# Altium project 2560_TrainingKit.PrjPcb (part 1 of 4)
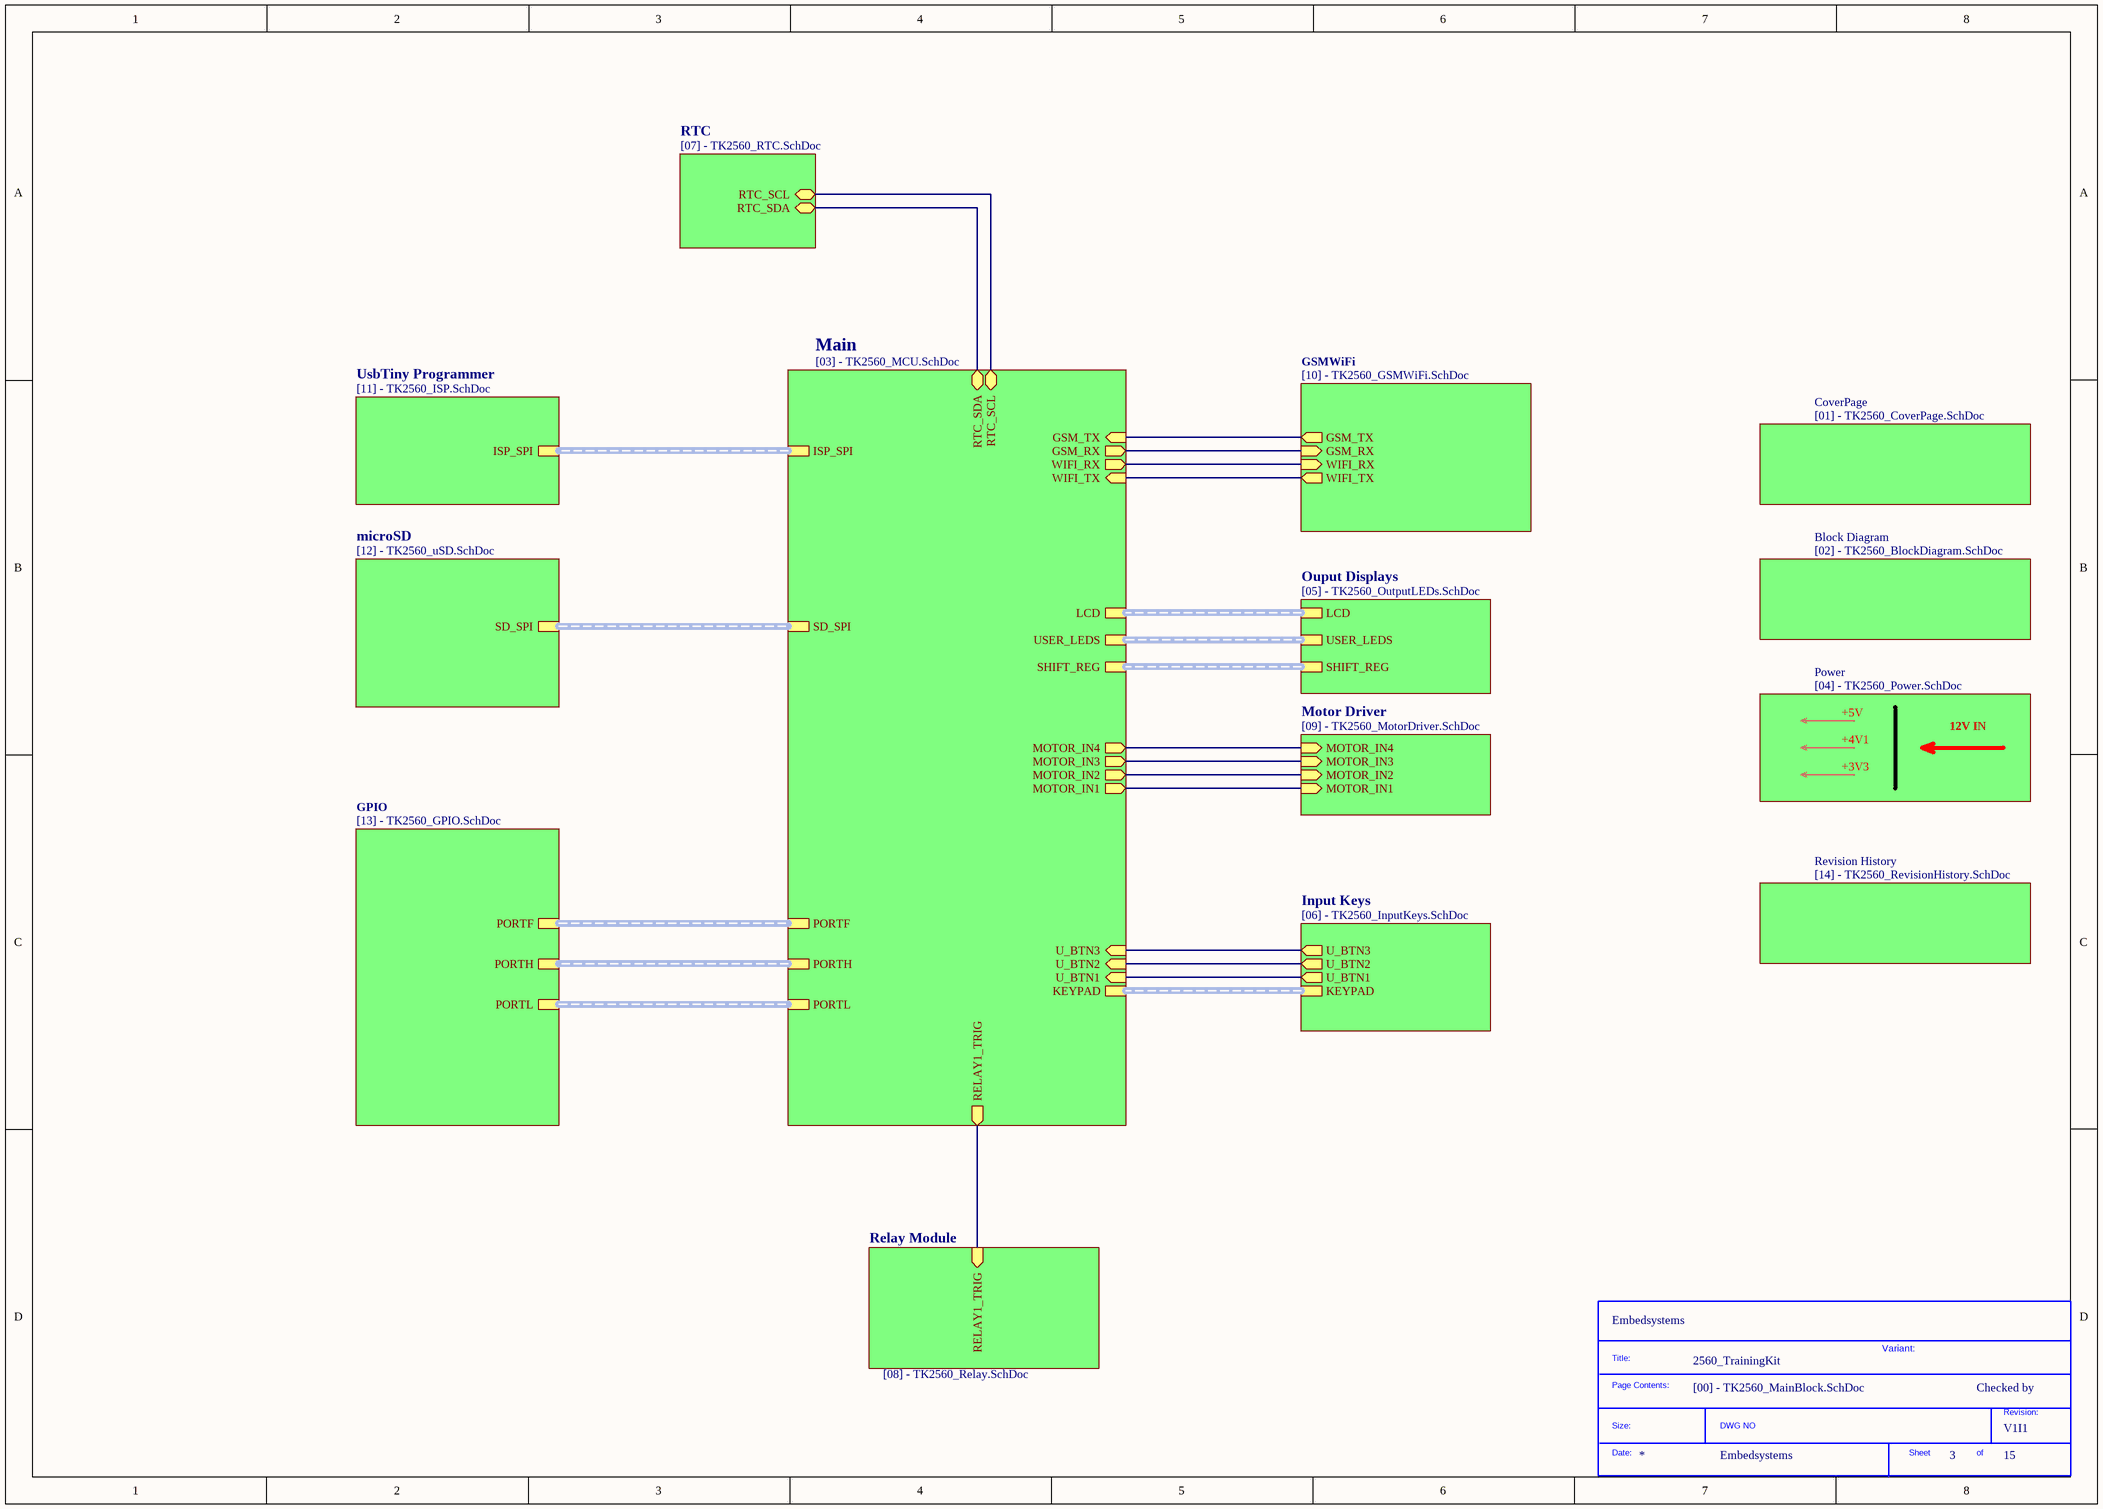
[diagram p0: [00] - TK2560_MainBlock.SchDoc]
COMPANY: Embedsystems; NotFitted: NF; Project: 2560_TrainingKit; Title: 2560_TrainingKit; VersionRevision: V1I1
15 sheets, 182 parts. Net scope: hierarchical (ports join the sheet entries above them; power ports are global).
Board file: TK2560_PCB.PcbDoc
Sheets:
  [00] - TK2560_MainBlock.SchDoc
    Main = [03] - TK2560_MCU.SchDoc
    Power = [04] - TK2560_Power.SchDoc
    Input Keys = [06] - TK2560_InputKeys.SchDoc
    Ouput Displays = [05] - TK2560_OutputLEDs.SchDoc
    CoverPage = [01] - TK2560_CoverPage.SchDoc
    Block Diagram = [02] - TK2560_BlockDiagram.SchDoc
    Motor Driver = [09] - TK2560_MotorDriver.SchDoc
    UsbTiny Programmer = [11] - TK2560_ISP.SchDoc
    RTC = [07] - TK2560_RTC.SchDoc
    Relay Module = [08] - TK2560_Relay.SchDoc
    microSD = [12] - TK2560_uSD.SchDoc
    Revision History = [14] - TK2560_RevisionHistory.SchDoc
    GPIO = [13] - TK2560_GPIO.SchDoc
    GSMWiFi = [10] - TK2560_GSMWiFi.SchDoc

## Sheet [00] - TK2560_MainBlock.SchDoc: 2560_TrainingKit
size A3; SheetNumber: 3; SheetTotal: 15

### Parts
(Parts that share a designator on the sheet are numbered #1, #2 ... from top to bottom, then left to right.)
*?#1  SDTitleBlock  (value not drawn)  (graphical)

### Sub-sheets
Block Diagram = [02] - TK2560_BlockDiagram.SchDoc: no entries
CoverPage = [01] - TK2560_CoverPage.SchDoc: no entries
GPIO = [13] - TK2560_GPIO.SchDoc: PORTL (harness PORTL), PORTH (harness PORTH), PORTF (harness PORTF)
GSMWiFi = [10] - TK2560_GSMWiFi.SchDoc: GSM_TX (out), GSM_RX (in), WIFI_RX (in), WIFI_TX (out)
Input Keys = [06] - TK2560_InputKeys.SchDoc: U_BTN1 (out), U_BTN2 (out), U_BTN3 (out), KEYPAD (harness KEYPAD)
Main = [03] - TK2560_MCU.SchDoc: SD_SPI (harness SD_SPI), KEYPAD (harness KEYPAD), LCD (harness LCD), RTC_SCL (bidir), ISP_SPI (harness ISP_SPI), RELAY1_TRIG (out), U_BTN1 (in), RTC_SDA (bidir), U_BTN2 (in), USER_LEDS (harness USER_LEDS), U_BTN3 (in), PORTF (harness PORTF), SHIFT_REG (harness SHIFT_REG), GSM_RX (out), GSM_TX (in), WIFI_TX (in), WIFI_RX (out), MOTOR_IN4 (out), MOTOR_IN1 (out), MOTOR_IN3 (out), MOTOR_IN2 (out), PORTL (harness PORTL), PORTH (harness PORTH)
microSD = [12] - TK2560_uSD.SchDoc: SD_SPI (harness SD_SPI)
Motor Driver = [09] - TK2560_MotorDriver.SchDoc: MOTOR_IN1 (in), MOTOR_IN4 (in), MOTOR_IN2 (in), MOTOR_IN3 (in)
Ouput Displays = [05] - TK2560_OutputLEDs.SchDoc: USER_LEDS (harness USER_LEDS), LCD (harness LCD), SHIFT_REG (harness SHIFT_REG)
Power = [04] - TK2560_Power.SchDoc: no entries
Relay Module = [08] - TK2560_Relay.SchDoc: RELAY1_TRIG (in)
Revision History = [14] - TK2560_RevisionHistory.SchDoc: no entries
RTC = [07] - TK2560_RTC.SchDoc: RTC_SCL (bidir), RTC_SDA (bidir)
UsbTiny Programmer = [11] - TK2560_ISP.SchDoc: ISP_SPI (harness ISP_SPI)

### Nets
GSM_RX: sheet Main/GSM_RX, sheet GSMWiFi/GSM_RX
GSM_TX: sheet Main/GSM_TX, sheet GSMWiFi/GSM_TX
MOTOR_IN1: sheet Main/MOTOR_IN1, sheet Motor Driver/MOTOR_IN1
MOTOR_IN2: sheet Main/MOTOR_IN2, sheet Motor Driver/MOTOR_IN2
MOTOR_IN3: sheet Main/MOTOR_IN3, sheet Motor Driver/MOTOR_IN3
MOTOR_IN4: sheet Main/MOTOR_IN4, sheet Motor Driver/MOTOR_IN4
RELAY1_TRIG: sheet Main/RELAY1_TRIG, sheet Relay Module/RELAY1_TRIG
RTC_SCL: sheet Main/RTC_SCL, sheet RTC/RTC_SCL
RTC_SDA: sheet Main/RTC_SDA, sheet RTC/RTC_SDA
U_BTN1: sheet Main/U_BTN1, sheet Input Keys/U_BTN1
U_BTN2: sheet Main/U_BTN2, sheet Input Keys/U_BTN2
U_BTN3: sheet Main/U_BTN3, sheet Input Keys/U_BTN3
WIFI_RX: sheet Main/WIFI_RX, sheet GSMWiFi/WIFI_RX
WIFI_TX: sheet Main/WIFI_TX, sheet GSMWiFi/WIFI_TX

### Buses and harness runs
harness sheet GPIO/PORTF = sheet Main/PORTF
harness sheet GPIO/PORTH = sheet Main/PORTH
harness sheet GPIO/PORTL = sheet Main/PORTL
harness sheet Input Keys/KEYPAD = sheet Main/KEYPAD
harness sheet Main/ISP_SPI = sheet UsbTiny Programmer/ISP_SPI
harness sheet Main/LCD = sheet Ouput Displays/LCD
harness sheet Main/SD_SPI = sheet microSD/SD_SPI
harness sheet Main/SHIFT_REG = sheet Ouput Displays/SHIFT_REG
harness sheet Main/USER_LEDS = sheet Ouput Displays/USER_LEDS

### Notes on the sheet
- +5V
- +4V1
- +3V3
- 12V IN
- Variant:
- Checked by
- (in symbol SDTitleBlock) Title:; Page Contents:; Revision:; Size:; DWG NO; Date:; Sheet; of

## Sheet [03] - TK2560_MCU.SchDoc: 2560_TrainingKit
size A2; Organization: Altium Limited; Address1: L3, 12a Rodborough Rd; Address2: Frenchs Forest; Address3: NSW; Address4: Australia 2086; SheetNumber: 4; SheetTotal: 15
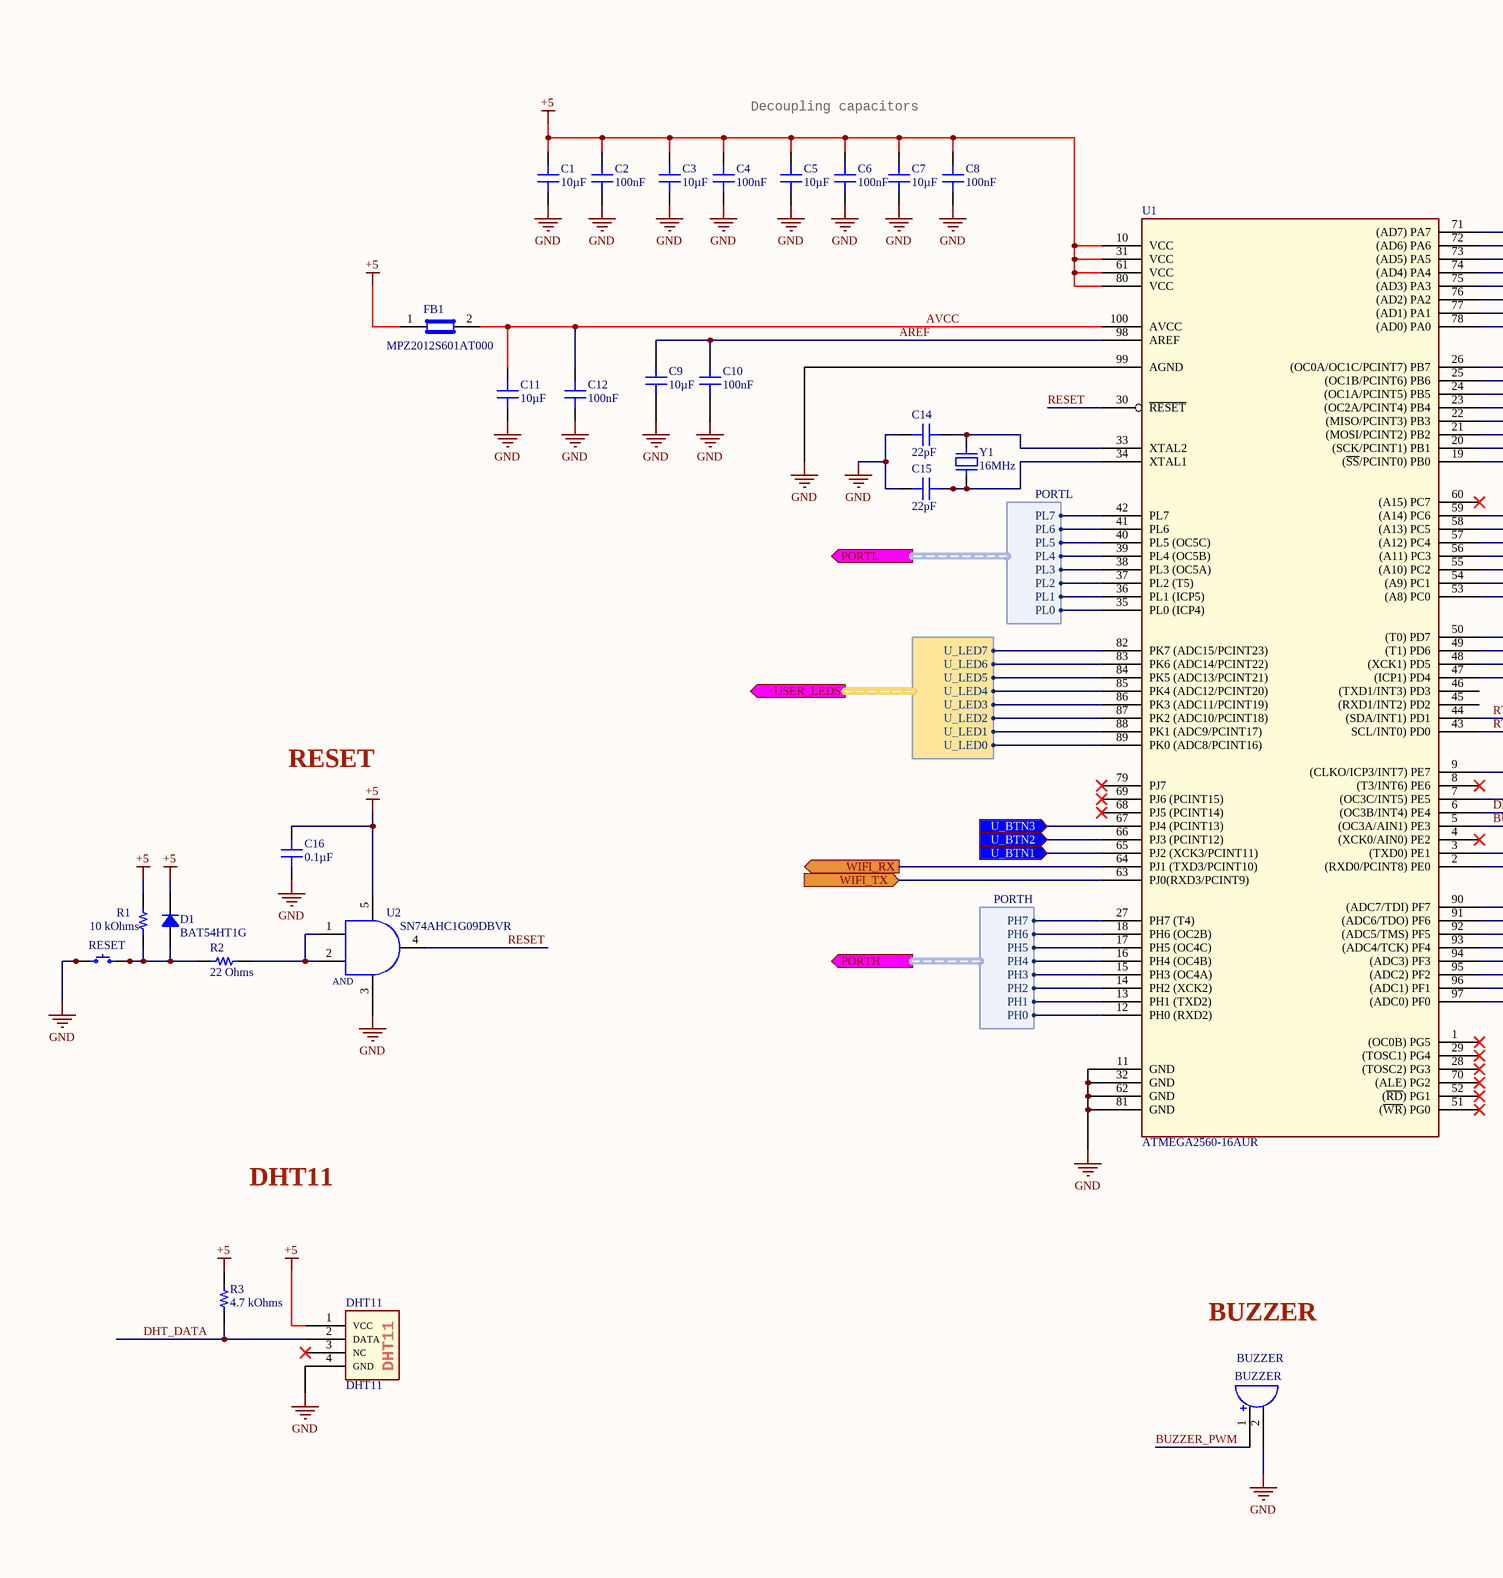
[diagram p1: [03] - TK2560_MCU.SchDoc, left]
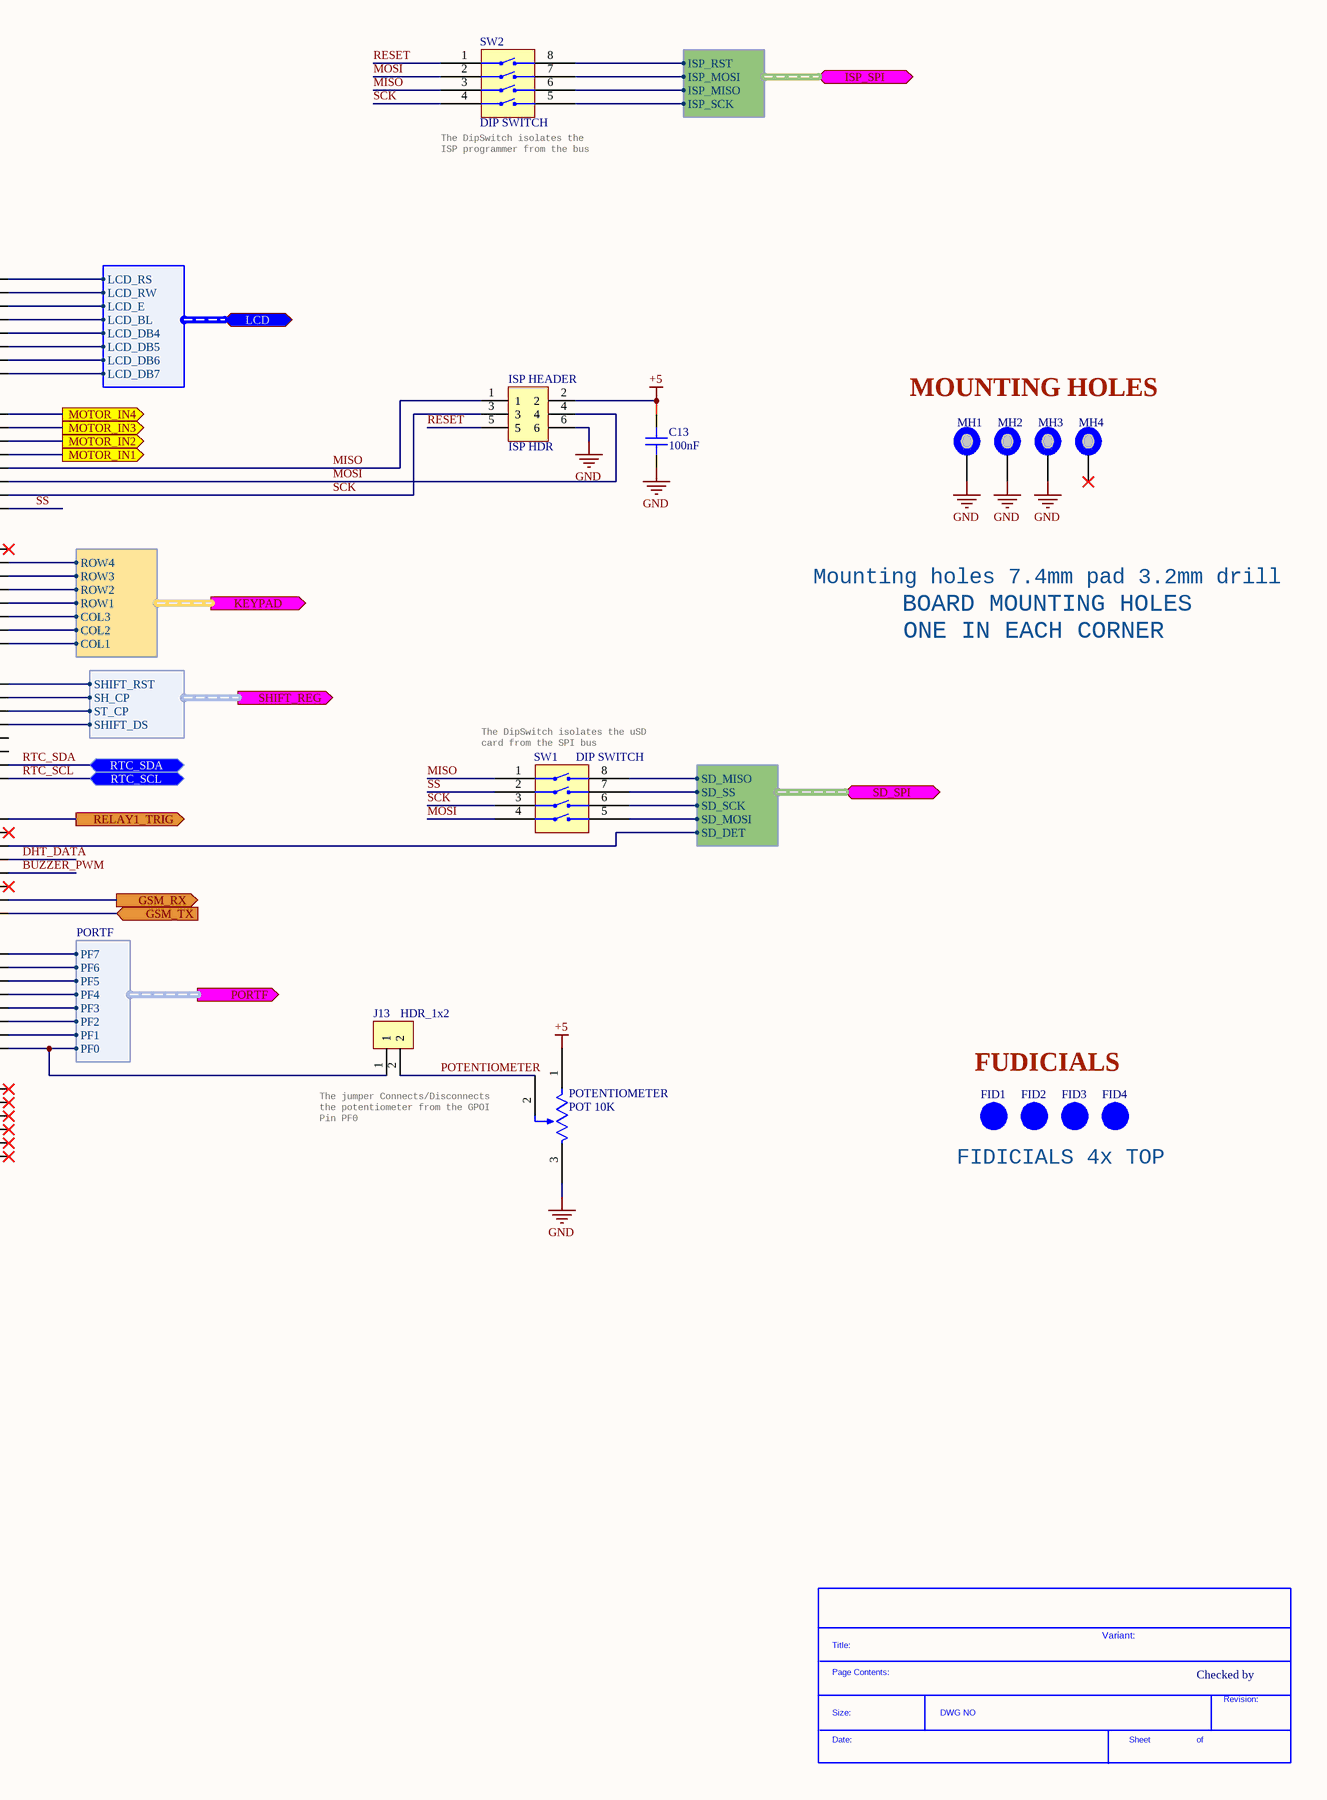
[diagram p2: [03] - TK2560_MCU.SchDoc, right]

### Parts
(Parts that share a designator on the sheet are numbered #1, #2 ... from top to bottom, then left to right.)
*?#2  SDTitleBlock  (value not drawn)  (graphical)
BUZZER  BUZZER  [BUZZER]
C1  10µF  [CAP 0805_2012]
C2  100nF  [CAP 0805_2012]
C3  10µF  [CAP 0805_2012]
C4  100nF  [CAP 0805_2012]
C5  10µF  [CAP 0805_2012]
C6  100nF  [CAP 0805_2012]
C7  10µF  [CAP 0805_2012]
C8  100nF  [CAP 0805_2012]
C9  10µF  [CAP 0805_2012]
C10  100nF  [CAP 0805_2012]
C11  10µF  [CAP 0805_2012]
C12  100nF  [CAP 0805_2012]
C13  100nF  [CAP 0805_2012]
C14  22pF  [CAP 0805_2012]
C15  22pF  [CAP 0805_2012]
C16  0.1µF  [CAP 0805_2012]
D1  BAT54HT1G  [SOD323]
DHT11  DHT11  [DHT11]
FB1  MPZ2012S601AT000  [C0805]
FID1  FID_1MM  [FID_40x120]  (value not drawn)
FID2  FID_1MM  [FID_40x120]  (value not drawn)
FID3  FID_1MM  [FID_40x120]  (value not drawn)
FID4  FID_1MM  [FID_40x120]  (value not drawn)
ISP_HEADER  ISP HDR  [HDR_2x3]
J13  HDR_1x2  [HDR_1x2]
MH1  MH_7.4MMC_3.2MMD  [MH_7.4MMC_3.2MMD]  (value not drawn)
MH2  MH_7.4MMC_3.2MMD  [MH_7.4MMC_3.2MMD]  (value not drawn)
MH3  MH_7.4MMC_3.2MMD  [MH_7.4MMC_3.2MMD]  (value not drawn)
MH4  MH_7.4MMNC_3.2MMD  [MH_7.4MM_3.2MMD_NON_COPPER_NPTH]  (value not drawn)
POTENTIOMETER  POT 10K  [5MM_POT]
R1  10 kOhms  [RES 0805_2012]
R2  22 Ohms  [RES 0805_2012]
R3  4.7 kOhms  [RES 0805_2012]
RESET  PTS645SM43SMTR92 LFS  [C&K PTS645]  (value not drawn)
SW1  DIP SWITCH  [CTS 218-4LPJ]
SW2  DIP SWITCH  [CTS 218-4LPJ]
U1  ATMEGA2560-16AUR  [100pinTQFP]
U2  SN74AHC1G09DBVR  [DBV_SOP_23_5]
Y1  16MHz  [ABRACON ABLS]

### Ports
GSM_RX (out), GSM_TX (in), ISP_SPI (bidir, harness ISP_SPI), KEYPAD (out, harness KEYPAD), LCD (bidir, harness LCD), MOTOR_IN1 (out), MOTOR_IN2 (out), MOTOR_IN3 (out), MOTOR_IN4 (out), PORTF (out, harness PORTF), PORTH (out, harness PORTH), PORTL (out, harness PORTL), RELAY1_TRIG (out), RTC_SCL (bidir), RTC_SDA (bidir), SD_SPI (bidir, harness SD_SPI), SHIFT_REG (out, harness SHIFT_REG), U_BTN1 (in), U_BTN2 (in), U_BTN3 (in), USER_LEDS (out, harness USER_LEDS), WIFI_RX (out), WIFI_TX (in)

### Harnesses
LCD: LCD_RS, LCD_RW, LCD_E, LCD_BL, LCD_DB4, LCD_DB5, LCD_DB6, LCD_DB7
PORTF: PF0, PF1, PF2, PF3, PF4, PF5, PF6, PF7
SHIFT_REG: SHIFT_RST, SH_CP, ST_CP, SHIFT_DS
USER_LEDS: U_LED0, U_LED1, U_LED2, U_LED3, U_LED4, U_LED5, U_LED6, U_LED7
ISP_SPI: ISP_RST, ISP_MOSI, ISP_MISO, ISP_SCK
SD_SPI: SD_MISO, SD_SS, SD_SCK, SD_MOSI, SD_DET
PORTH: PH0, PH1, PH2, PH3, PH4, PH5, PH6, PH7
PORTL: PL0, PL1, PL2, PL3, PL4, PL5, PL6, PL7
KEYPAD: ROW1, ROW2, ROW3, ROW4, COL1, COL2, COL3

### Nets
+5: C1.2 C2.2 C3.2 C4.2 C5.2 C6.2 C7.2 C8.2 C13.2 C16.2 D1.2 DHT11.1(VCC) FB1.1 ISP_HEADER.2 POTENTIOMETER.1 R1.2 R3.2 U1.10(VCC) U1.31(VCC) U1.61(VCC) U1.80(VCC) U2.5
GND: BUZZER.2 C1.1 C2.1 C3.1 C4.1 C5.1 C6.1 C7.1 C8.1 C9.1 C10.1 C11.1 C12.1 C13.1 C14.1 C15.1 C16.1 DHT11.4(GND) ISP_HEADER.6 MH1.1 MH2.1 MH3.1 POTENTIOMETER.3 RESET.1 RESET.2 U1.11(GND) U1.32(GND) U1.62(GND) U1.81(GND) U1.99(AGND) U2.3
AREF: C9.2 C10.2 U1.98(AREF)
AVCC: C11.2 C12.2 FB1.2 U1.100(AVCC)
BUZZER_PWM: BUZZER.1 U1.5((OC3A/AIN1)_PE3)
DHT_DATA: DHT11.2(DATA) R3.1 U1.6((OC3B/INT4)_PE4)
GSM_RX: U1.3((TXD0)_PE1) ; port GSM_RX
GSM_TX: U1.2((RXD0/PCINT8)_PE0) ; port GSM_TX
MISO: ISP_HEADER.1 SW1.1(GND) SW2.3(GND) U1.22((MISO/PCINT3)_PB3)
MOSI: ISP_HEADER.4 SW1.4(GND) SW2.2(GND) U1.21((MOSI/PCINT2)_PB2)
MOTOR_IN1: U1.23((OC2A/PCINT4)_PB4) ; port MOTOR_IN1
MOTOR_IN2: U1.24((OC1A/PCINT5)_PB5) ; port MOTOR_IN2
MOTOR_IN3: U1.25((OC1B/PCINT6)_PB6) ; port MOTOR_IN3
MOTOR_IN4: U1.26((OC0A/OC1C/PCINT7)_PB7) ; port MOTOR_IN4
POTENTIOMETER: J13.2 POTENTIOMETER.2
RELAY1_TRIG: U1.9((CLKO/ICP3/INT7)_PE7) ; port RELAY1_TRIG
RESET: ISP_HEADER.5 SW2.1(GND) U1.30(~{RESET}) U2.4
RTC_SCL: U1.43(SCL/INT0)_PD0) ; port RTC_SCL
RTC_SDA: U1.44((SDA/INT1)_PD1) ; port RTC_SDA
SCK: ISP_HEADER.3 SW1.3(GND) SW2.4(GND) U1.20((SCK/PCINT1)_PB1)
SS: SW1.2(GND) U1.19((~{SS}/PCINT0)_PB0)
U_BTN1: U1.65(PJ2_(XCK3/PCINT11)) ; port U_BTN1
U_BTN2: U1.66(PJ3_(PCINT12)) ; port U_BTN2
U_BTN3: U1.67(PJ4_(PCINT13)) ; port U_BTN3
WIFI_RX: U1.64(PJ1_(TXD3/PCINT10)) ; port WIFI_RX
WIFI_TX: U1.63(PJ0(RXD3/PCINT9)) ; port WIFI_TX
NetC14_2: C14.2 U1.33(XTAL2) Y1.2
NetC15_2: C15.2 U1.34(XTAL1) Y1.1
NetD1_1: D1.1 R1.1 R2.1 RESET.3 RESET.4
NetGPIO_9: U1.90((ADC7/TDI)_PF7) ; port PORTF.PF7
NetGPIO_10: U1.91((ADC6/TDO)_PF6) ; port PORTF.PF6
NetGPIO_11: U1.92((ADC5/TMS)_PF5) ; port PORTF.PF5
NetGPIO_12: U1.93((ADC4/TCK)_PF4) ; port PORTF.PF4
NetGPIO_13: U1.94((ADC3)_PF3) ; port PORTF.PF3
NetGPIO_14: U1.95((ADC2)_PF2) ; port PORTF.PF2
NetGPIO_15: U1.96((ADC1)_PF1) ; port PORTF.PF1
NetGPIO_16: J13.1 U1.97((ADC0)_PF0) ; port PORTF.PF0
NetIC2_10: SW1.5 ; port SD_SPI.SD_MOSI
NetIC2_11: SW1.6 ; port SD_SPI.SD_SCK
NetIC2_12: SW1.7 ; port SD_SPI.SD_SS
NetIC2_13: SW1.8 ; port SD_SPI.SD_MISO
NetJ12_1: U1.42(PL7) ; port PORTL.PL7
NetJ12_2: U1.41(PL6) ; port PORTL.PL6
NetJ12_3: U1.40(PL5_(OC5C)) ; port PORTL.PL5
NetJ12_4: U1.39(PL4_(OC5B)) ; port PORTL.PL4
NetJ12_5: U1.38(PL3_(OC5A)) ; port PORTL.PL3
NetJ12_6: U1.37(PL2_(T5)) ; port PORTL.PL2
NetJ12_7: U1.36(PL1_(ICP5)) ; port PORTL.PL1
NetJ12_8: U1.35(PL0_(ICP4)) ; port PORTL.PL0
NetJ12_9: U1.12(PH0_(RXD2)) ; port PORTH.PH0
NetJ12_10: U1.13(PH1_(TXD2)) ; port PORTH.PH1
NetJ12_11: U1.14(PH2_(XCK2)) ; port PORTH.PH2
NetJ12_12: U1.15(PH3_(OC4A)) ; port PORTH.PH3
NetJ12_13: U1.16(PH4_(OC4B)) ; port PORTH.PH4
NetJ12_14: U1.17(PH5_(OC4C)) ; port PORTH.PH5
NetJ12_15: U1.18(PH6_(OC2B)) ; port PORTH.PH6
NetJ12_16: U1.27(PH7_(T4)) ; port PORTH.PH7
NetKEYPAD1_1: U1.53((A8)_PC0) ; port KEYPAD.COL1
NetKEYPAD1_2: U1.54((A9)_PC1) ; port KEYPAD.COL2
NetKEYPAD1_3: U1.55((A10)_PC2) ; port KEYPAD.COL3
NetKEYPAD1_4: U1.56((A11)_PC3) ; port KEYPAD.ROW1
NetKEYPAD1_5: U1.57((A12)_PC4) ; port KEYPAD.ROW2
NetKEYPAD1_6: U1.58((A13)_PC5) ; port KEYPAD.ROW3
NetKEYPAD1_7: U1.59((A14)_PC6) ; port KEYPAD.ROW4
NetLCD_DISPLAY_1602_4: U1.71((AD7)_PA7) ; port LCD.LCD_RS
NetLCD_DISPLAY_1602_5: U1.72((AD6)_PA6) ; port LCD.LCD_RW
NetLCD_DISPLAY_1602_6: U1.73((AD5)_PA5) ; port LCD.LCD_E
NetLCD_DISPLAY_1602_11: U1.75((AD3)_PA3) ; port LCD.LCD_DB4
NetLCD_DISPLAY_1602_12: U1.76((AD2)_PA2) ; port LCD.LCD_DB5
NetLCD_DISPLAY_1602_13: U1.77((AD1)_PA1) ; port LCD.LCD_DB6
NetLCD_DISPLAY_1602_14: U1.78((AD0)_PA0) ; port LCD.LCD_DB7
NetLCD_DISPLAY_1602_15: U1.74((AD4)_PA4) ; port LCD.LCD_BL
NetR2_2: R2.2 U2.1 U2.2
NetR10_2: U1.82(PK7_(ADC15/PCINT23)) ; port USER_LEDS.U_LED7
NetR11_2: U1.83(PK6_(ADC14/PCINT22)) ; port USER_LEDS.U_LED6
NetR12_2: U1.84(PK5_(ADC13/PCINT21)) ; port USER_LEDS.U_LED5
NetR13_2: U1.85(PK4_(ADC12/PCINT20)) ; port USER_LEDS.U_LED4
NetR14_2: U1.86(PK3_(ADC11/PCINT19)) ; port USER_LEDS.U_LED3
NetR15_2: U1.87(PK2_(ADC10/PCINT18)) ; port USER_LEDS.U_LED2
NetR16_2: U1.88(PK1_(ADC9/PCINT17)) ; port USER_LEDS.U_LED1
NetR17_2: U1.89(PK0_(ADC8/PCINT16)) ; port USER_LEDS.U_LED0
NetR32_1: SW2.7 ; port ISP_SPI.ISP_MOSI
NetR34_1: SW2.5 ; port ISP_SPI.ISP_SCK
NetR38_2: U1.7((OC3C/INT5)_PE5) ; port SD_SPI.SD_DET
NetSW2_6: SW2.6 ; port ISP_SPI.ISP_MISO
NetSW2_8: SW2.8 ; port ISP_SPI.ISP_RST
NetU1_47: U1.47((ICP1)_PD4) ; port SHIFT_REG.SHIFT_DS
NetU1_48: U1.48((XCK1)_PD5) ; port SHIFT_REG.ST_CP
NetU1_49: U1.49((T1)_PD6) ; port SHIFT_REG.SH_CP
NetU1_50: U1.50((T0)_PD7) ; port SHIFT_REG.SHIFT_RST

Not connected (* = marked no-connect by the designer): DHT11 3(NC)*; MH4 1*; U1 1((OC0B)_PG5)* 4((XCK0/AIN0)_PE2)* 8((T3/INT6)_PE6)* 28((TOSC2)_PG3)* 29((TOSC1)_PG4)* 45((RXD1/INT2)_PD2) 46((TXD1/INT3)_PD3) 51((~{WR})_PG0)* 52((~{RD})_PG1)* 60((A15)_PC7)* 68(PJ5_(PCINT14))* 69(PJ6_(PCINT15))* 70((ALE)_PG2)* 79(PJ7)*

### Notes on the sheet
- Decoupling capacitors
- (near SW2) The DipSwitch isolates the ISP programmer from the bus
- MOUNTING HOLES
- Mounting holes 7.4mm pad 3.2mm drill
- BOARD MOUNTING HOLES
- ONE IN EACH CORNER
- RESET
- (near SW1) The DipSwitch isolates the uSD card from the SPI bus
- FUDICIALS
- The jumper Connects/Disconnects the potentiometer from the GPOI Pin PF0
- FIDICIALS 4x TOP
- DHT11
- BUZZER
- Variant:
- Checked by
- Title
- Size:
- Date:
- File:
- A2
- Number:
- Time:
- Revision:
- Sheet
- of
- (in symbol SDTitleBlock) Title:; Page Contents:; Revision:; Size:; DWG NO; Date:; Sheet; of
- (in symbol SN74AHC1G09DBVR) AND

### Library data of the parts
BUZZER = BUZZER: AUDIO MAGNETIC XDCR 3-7V TH; Manufacturer: Projects Unlimited; Manufacturer Part Number: AT-1224-TWT-5V-2-R; Voltage Rating: 5V; Frequency: 2.4kHz; Operating Supply Current: 40mA; RoHS: Yes; Category: Audio Products; Stock 1: 83564; Pricing 1: 1=0.61000, 5=0.54600, 10=0.52000, 25=0.48640, 50=0.46120, 100=0.43680, 500=0.38252, 1000=0.36032, 5000=0.31168 (USD); Mount: Through Hole; Contact Plating: Tin; Min Operating Temperature: -30°C; Max Operating Temperature: 70°C; Packaging: Tray; Termination: PC Pins; Sensing Method: Magnetic; Max Supply Current: 40mA; Diameter: 12mm; Height: 9mm; ComponentLink1URL: http://www.mouser.com/ds/2/334/AT-1224-TWT-5V-2-R-532234.pdf?src-supplier=Mouser; ComponentLink1Description: http://www.mouser.com/ds/2/334/AT-1224-TWT-5V-2-R-532234.pdf?src-supplier=Mouser; ComponentLink2URL: http://www.puiaudio.com/pdf/AT-1224-TWT-5V-2-R.pdf?src-supplier=Digi-Key; ComponentLink2Description: http://www.puiaudio.com/pdf/AT-1224-TWT-5V-2-R.pdf?src-supplier=Digi-Key; ComponentLink3URL: http://www.puiaudio.com/pdf/AT-1224-TWT-5V-2-R.pdf?src-supplier=Avnet; ComponentLink3Description: http://www.puiaudio.com/pdf/AT-1224-TWT-5V-2-R.pdf?src-supplier=Avnet; Supplier 1: Digi-Key; Supplier Part Number 1: 668-1470-ND
C1 C3 C5 C7 C9 C11 = 0805BW106K160NGT: CAP CER 10UF 16V X5R 0805; Manufacturer: Knowles Novacap; Tolerance: ±10%; Part Number: 0805BW106K160NGT; Value: 10µF; Applications: General Purpose; Capacitance: 10µF; ComponentLink1Description: Datasheet; ComponentLink1URL: https://www.knowlescapacitors.com/getattachment/6c8d48ef-fc2b-4752-ae2c-ce6c208de0c4/High-Capacitance-Chip.aspx; ComponentLink2Description: DigiKey Link; ComponentLink2URL: http://digikey.com/product-detail/en/knowles-novacap/0805BW106K160NGT/1763-1170-1-ND/7303990; Device Package: 0805 (2012 Metric); Features: Gold Flash Termination; LastUpdated: 02/09/2020 01:04:27; Lifecycle Status: Active; Minimum Order: 1; Mounting Type: Surface Mount, MLCC; Operating Temperature: -55°C ~ 85°C; Package / Case: 0805 (2012 Metric); Packaging: TapeAndReel; PartId: 10571; Part Status: Active; Price: 1.32; Series: -; Size / Dimension: 0.080" L x 0.050" W (2.03mm x 1.27mm); Supplier 1: DigiKey; Supplier Part Number 1: 1763-1170-1-ND; Temperature Coefficient: X5R; Thickness (Max): 0.054" (1.37mm); Voltage - Rated: 16V
C2 C4 C6 C8 C10 C12 C13 = AC0805KKX8R9BB104: CAP CER 0805 10% X8R 50V 100NF; Manufacturer: Yageo; Capacitance: 0.1µF; Part Number: AC0805KKX8R9BB104; Value: 100nF; Applications: Automotive; ComponentLink1Description: Datasheet; ComponentLink1URL: http://www.yageo.com/documents/recent/AC0805KKX8R9BB104.pdf; ComponentLink2Description: DigiKey Link; ComponentLink2URL: http://digikey.com/product-detail/en/yageo/AC0805KKX8R9BB104/311-4624-1-ND/9699550; Device Package: 0805 (2012 Metric); LastUpdated: 02/09/2020 01:04:20; Lifecycle Status: Active; Minimum Order: 1; Mounting Type: Surface Mount, MLCC; Operating Temperature: -55°C ~ 150°C; Package / Case: 0805 (2012 Metric); Packaging: TapeAndReel; PartId: 14076; Part Status: Active; Price: 0.06; Ratings: AEC-Q200; Series: AC; Size / Dimension: 0.079" L x 0.049" W (2.00mm x 1.25mm); Supplier 1: DigiKey; Supplier Part Number 1: 311-4624-1-ND; Temperature Coefficient: X8R; Thickness (Max): 0.057" (1.45mm); Tolerance: ±10%; Voltage - Rated: 50V
C14 C15 = 08051A220GAT2A: CAP CER 22PF 100V C0G/NP0 0805; Manufacturer: AVX Corporation; Temperature Coefficient: C0G, NP0; Tolerance: ±2%; Part Number: 08051A220GAT2A; Value: 22pF; Applications: General Purpose; Capacitance: 22pF; ComponentLink1Description: Datasheet; ComponentLink1URL: http://datasheets.avx.com/C0GNP0-Dielectric.pdf; ComponentLink2Description: DigiKey Link; ComponentLink2URL: http://digikey.com/product-detail/en/avx-corporation/08051A220GAT2A/478-10819-1-ND/7536356; Device Package: 0805 (2012 Metric); LastUpdated: 02/09/2020 01:04:39; Lifecycle Status: Active; Minimum Order: 1; Mounting Type: Surface Mount, MLCC; Operating Temperature: -55°C ~ 125°C; Package / Case: 0805 (2012 Metric); Packaging: TapeAndReel; PartId: 3991; Part Status: Active; Price: 0.10; Series: -; Size / Dimension: 0.079" L x 0.049" W (2.01mm x 1.25mm); Supplier 1: DigiKey; Supplier Part Number 1: 478-10819-1-ND; Thickness (Max): 0.037" (0.94mm); Voltage - Rated: 100V
C16 = AC0805KKX8R9BB104: CAP CER 0805 10% X8R 50V 100NF; Manufacturer: Yageo; Part Number: AC0805KKX8R9BB104; Value: 0.1µF; Applications: Automotive; Capacitance: 0.1µF; ComponentLink1Description: Datasheet; ComponentLink1URL: http://www.yageo.com/documents/recent/AC0805KKX8R9BB104.pdf; ComponentLink2Description: DigiKey Link; ComponentLink2URL: http://digikey.com/product-detail/en/yageo/AC0805KKX8R9BB104/311-4624-1-ND/9699550; Device Package: 0805 (2012 Metric); LastUpdated: 02/09/2020 01:04:20; Lifecycle Status: Active; Minimum Order: 1; Mounting Type: Surface Mount, MLCC; Operating Temperature: -55°C ~ 150°C; Package / Case: 0805 (2012 Metric); Packaging: TapeAndReel; PartId: 14076; Part Status: Active; Price: 0.06; Ratings: AEC-Q200; Series: AC; Size / Dimension: 0.079" L x 0.049" W (2.00mm x 1.25mm); Supplier 1: DigiKey; Supplier Part Number 1: 311-4624-1-ND; Temperature Coefficient: X8R; Thickness (Max): 0.057" (1.45mm); Tolerance: ±10%; Voltage - Rated: 50V
D1 = BAT54HT1G: DIODE SCHOTTKY 30V 200MA SOD323; Manufacturer: ON Semiconductor; Capacitance @ Vr, F: 10pF @ 1V, 1MHz; Current - Average Rectified (Io): 200mA (DC); Current - Reverse Leakage @ Vr: 2µA @ 25V; Reverse Recovery Time (trr): 5ns; Speed: Small Signal =< 200mA (Io), Any Speed; Voltage - Forward (Vf) (Max) @ If: 800mV @ 100mA; Part Number: BAT54HT1G; ComponentLink1Description: Datasheet; ComponentLink1URL: //media.digikey.com/pdf/Data%20Sheets/Fairchild%20PDFs/BAT54HT1G_Rev_1.2.pdf; ComponentLink2Description: DigiKey Link; ComponentLink2URL: http://digikey.com/product-detail/en/on-semiconductor/BAT54HT1G/BAT54HT1GOSCT-ND/917809; Diode Type: Schottky; LastUpdated: 02/09/2020 01:27:26; Lifecycle Status: Active; Minimum Order: 1; Mounting Type: Surface Mount; Operating Temperature - Junction: -55°C ~ 150°C; Package / Case: SC-76, SOD-323; Packaging: TapeAndReel; PartId: 3080; Part Status: Active; Price: 0.03; Supplier 1: DigiKey; Supplier Part Number 1: BAT54HT1GOSCT-ND; Supplier Device Package: SOD-323; Voltage - DC Reverse (Vr) (Max): 30V
DHT11 = DHT11: SENSOR HUMID/TEMP 5V DTL 5% MOD; Manufacturer: Adafruit Industries; Manufacturer Part Number: 386; Response Time: 1s; Sensor Type: Temperature; Output Type: Digital; RoHS: Yes; Category: Optoelectronics; Stock 1: 753; Pricing 1: 1=5.00000 (USD); Mount: Chassis Mount; Min Operating Temperature: 0°C; Max Operating Temperature: 50°C; Accuracy: 5%; ComponentLink1URL: https://media.digikey.com/pdf/Data%20Sheets/Adafruit%20PDFs/DHT11_ProdManual.pdf?src-supplier=Digi-Key; ComponentLink1Description: https://media.digikey.com/pdf/Data%20Sheets/Adafruit%20PDFs/DHT11_ProdManual.pdf?src-supplier=Digi-Key; Supplier 1: Digi-Key; Supplier Part Number 1: 1528-1228-ND
FB1 = MPZ2012S601AT000: FERRITE BEAD 600 OHM 0805 1LN; Manufacturer: TDK; Impedance: 600R; Current Rating: 2A; DC Resistance (DCR): 100mR; Supplier 1: Digi-Key; Manufacturer Part Number: MPZ2012S601AT000; RoHS: Yes; Category: Ferrite Beads and Chips; Stock 1: 209203; Pricing 1: 1=0.11000, 10=0.09200, 25=0.08240, 50=0.06040, 100=0.05220, 250=0.04116, 500=0.03476, 1000=0.02928 (USD); Mount: Surface Mount; Case/Package: 0805; Case Code (Metric): 2012; Case Code (Imperial): 0805; Packaging: Tape and Reel; Package Quantity: 1; Max DC Current: 2A; Series: MPZ; Length: 0.079inch; Width: 0.049inch; Height: 0.041inch; REACH SVHC: No SVHC; Lead Free: Lead Free; RoHS Compliant: Yes; ComponentLink1URL: https://datasheet.ciiva.com/46634/beads-commercial-power-mpz-en-46634377.pdf?src-supplier=Digi-Key; ComponentLink1Description: https://datasheet.ciiva.com/46634/beads-commercial-power-mpz-en-46634377.pdf?src-supplier=Digi-Key; ComponentLink2URL: https://datasheet.ciiva.com/46634/beads-commercial-power-mpz-en-46634606.pdf?src-supplier=Digi-Key; ComponentLink2Description: https://datasheet.ciiva.com/46634/beads-commercial-power-mpz-en-46634606.pdf?src-supplier=Digi-Key; ComponentLink3URL: https://datasheet.ciiva.com/46634/beads-commercial-power-mpz-en-46634335.pdf?src-supplier=Digi-Key; ComponentLink3Description: https://datasheet.ciiva.com/46634/beads-commercial-power-mpz-en-46634335.pdf?src-supplier=Digi-Key; Supplier Part Number 1: 445-2206-1-ND
FID1-FID4 = FID_1MM: Fiducial 40mil Diameter, 120mil mask
ISP_HEADER = HDR 2x3: CONN HEADER 6POS .100 STR 30AU; Manufacturer: Amphenol FCI; Manufacturer Part Number: 67997-106HLF; Number of Contacts: 6; Current Rating: 3A; Voltage Rating: 1.5kV; Insulation Resistance: 5GR; Gender: Male; Connector Type: Male Pin; Pitch: 2.54mm; Row Spacing: 0.1inch; Contact Post Length: 3.05mm; Supplier 1: Digi-Key; RoHS: Yes; Category: Headers and Wire Housings; Stock 1: 1173; Pricing 1: 1=1.87000, 10=1.69500, 100=1.45300, 500=1.21082, 1000=1.03785, 5000=0.92023, 10000=0.89947 (USD); Mount: Through Hole; Contact Plating: Gold,GXT; Contact Material: Bronze; Color: Black; Housing Color: Black; Housing Material: Thermoplastic; Min Operating Temperature: -65°C; Max Operating Temperature: 125°C; Number of Rows: 2; Termination: Through Hole; Packaging: Bulk; Package Quantity: 100; Contact Gender: Male; Number of Positions: 6; Max Voltage Rating (AC): 1.5kV; Orientation: Straight; Series: 67997; Contact Type: Male Pin; Length: 7.62mm; Contact Mating Length: 0.23inch; Depth: 4.83mm; Radiation Hardening: No; REACH SVHC: No SVHC; Lead Free: Lead Free; Flammability Rating: UL94 V-0; RoHS Compliant: Yes; ComponentLink1URL: https://datasheet.ciiva.com/5153/67996-222463-5153820.pdf?src-supplier=Mouser; ComponentLink1Description: https://datasheet.ciiva.com/5153/67996-222463-5153820.pdf?src-supplier=Mouser; ComponentLink2URL: https://datasheet.ciiva.com/16726/67996-16726286.pdf?src-supplier=Avnet+Europe; ComponentLink2Description: https://datasheet.ciiva.com/16726/67996-16726286.pdf?src-supplier=Avnet+Europe; ComponentLink3URL: https://datasheet.ciiva.com/722/67996-722044.pdf?src-supplier=Digi-Key; ComponentLink3Description: https://datasheet.ciiva.com/722/67996-722044.pdf?src-supplier=Digi-Key; ComponentLink4URL: https://datasheet.ciiva.com/10149/67996-10149221.pdf?src-supplier=Avnet; ComponentLink4Description: https://datasheet.ciiva.com/10149/67996-10149221.pdf?src-supplier=Avnet; ComponentLink5URL: https://datasheet.ciiva.com/46393/1876884-46393067.pdf?src-supplier=Element14; ComponentLink5Description: https://datasheet.ciiva.com/46393/1876884-46393067.pdf?src-supplier=Element14; Supplier Part Number 1: 609-3393-ND
J13 = HDR_1x2: Pin Header 2.54MM Pitch Str, 1X2PIN, Full G/f, NY6T, 6.1MM*2.5MM*3.0MM / Bag; Manufacturer: Amphenol; Manufacturer Part Number: G800W306018EU; Supplier 1: Mouser; Stock 1: 1088; Pricing 1: 1=0.10000, 10=0.02700, 50=0.02700, 100=0.02600, 1000=0.02200, 10000=0.01900 (USD); RoHS Compliant: Yes; Supplier Part Number 1: 523-G800W306018EU
MH1-MH3 = MH_7.4MMC_3.2MMD: Mounting Hole 7.4mm Diameter, 3.2mm Dril
MH4 = MH_7.4MMNC_3.2MMD: Mounting Hole 7.4mm Diameter (Non Copper), 3.2mm Dril NPTH
POTENTIOMETER = POT 10K: Res Conductive Plastic POT 10K Ohm 20% 1/5W 1(Elec)/1(Mech)Turn 6mm Pin Panel Mount/Through Hole; Manufacturer: TT BI; Manufacturer Part Number: P160KN2-0QA25B10K; Number of Gangs: 1; Resistance: 10kR; Power Rating: 200mW; Actuator Length: 0.984inch; Actuator Diameter: 0.236inch; Supplier 1: Digi-Key; RoHS: Yes; Category: Variable Resistors and Potentiometers; Stock 1: 2543; Pricing 1: 1=0.79000, 10=0.71300, 25=0.64400, 50=0.62100, 100=0.58650, 250=0.56352, 880=0.50600, 1760=0.43700, 5280=0.35650 (USD); Mount: Panel; Min Operating Temperature: -20°C; Max Operating Temperature: 70°C; Taper: Linear; Number of Turns: 1; Termination: Pin; Tolerance: 20%; Packaging: Tray; Package Quantity: 100; Max Power Dissipation: 200mW; Type: Potentiometer; Resistor Type: Conductive Plastic; Length: 34.5mm; Depth: 17mm; Military Standard: Not; ComponentLink1URL: https://datasheet.ciiva.com/48425/p160-eng-tds-48425253.pdf?src-supplier=Distrelec; ComponentLink1Description: https://datasheet.ciiva.com/48425/p160-eng-tds-48425253.pdf?src-supplier=Distrelec; Supplier Part Number 1: 987-1715-ND
R1 = RT0805DRD0710KL: RES SMD 10K OHM 0.5% 1/8W 0805; Manufacturer: Yageo; Power (Watts): 0.125W, 1/8W; Temperature Coefficient: ±25ppm/°C; Part Number: RT0805DRD0710KL; Value: 10 kOhms; ComponentLink1Description: Datasheet; ComponentLink1URL: https://www.yageo.com/upload/media/product/productsearch/datasheet/rchip/PYu-RT_1-to-0.01_RoHS_L_11.pdf; ComponentLink2Description: DigiKey Link; ComponentLink2URL: http://digikey.com/product-detail/en/yageo/RT0805DRD0710KL/311-2699-1-ND/6129118; Composition: Thin Film; Device Package: 0805 (2012 Metric); Height - Seated (Max): 0.024" (0.60mm); LastUpdated: 02/09/2020 01:15:24; Lifecycle Status: Active; Minimum Order: 1; Number of Terminations: 2; Operating Temperature: -55°C ~ 155°C; Package / Case: 0805 (2012 Metric); Packaging: TapeAndReel; PartId: 27797; Part Status: Active; Price: 0.03; Resistance: 10 kOhms; Series: RT; Size / Dimension: 0.079" L x 0.049" W (2.00mm x 1.25mm); Supplier 1: DigiKey; Supplier Part Number 1: 311-2699-1-ND; Supplier Device Package: 0805; Tolerance: ±0.5%
R2 = RC0805JR-0722RL: RES SMD 22 OHM 5% 1/8W 0805; Manufacturer: Yageo; Power (Watts): 0.125W, 1/8W; Temperature Coefficient: ±100ppm/°C; Part Number: RC0805JR-0722RL; Value: 22 Ohms; ComponentLink1Description: Datasheet; ComponentLink1URL: https://www.yageo.com/upload/media/product/productsearch/datasheet/rchip/PYu-RC_Group_51_RoHS_L_10.pdf; ComponentLink2Description: DigiKey Link; ComponentLink2URL: http://digikey.com/product-detail/en/yageo/RC0805JR-0722RL/311-22ARCT-ND/731232; Composition: Thick Film; Device Package: 0805 (2012 Metric); Features: Moisture Resistant; Height - Seated (Max): 0.024" (0.60mm); LastUpdated: 02/09/2020 01:14:53; Lifecycle Status: Active; Minimum Order: 1; Number of Terminations: 2; Operating Temperature: -55°C ~ 155°C; Package / Case: 0805 (2012 Metric); Packaging: CutTape; PartId: 41770; Part Status: Active; Price: 0.10; Resistance: 22 Ohms; Series: RC; Size / Dimension: 0.079" L x 0.049" W (2.00mm x 1.25mm); Supplier 1: DigiKey; Supplier Part Number 1: 311-22ARCT-ND; Supplier Device Package: 0805; Tolerance: ±5%
R3 = RC0805FR-074K7P: RES SMD 4.7K OHM 1% 1/8W 0805; Manufacturer: Yageo; Power (Watts): 0.125W, 1/8W; Temperature Coefficient: ±100ppm/°C; Part Number: RC0805FR-074K7P; Value: 4.7 kOhms; ComponentLink1Description: Datasheet; ComponentLink1URL: http://www.yageo.com/NewPortal/yageodocoutput?fileName=/pdf/R-Chip/PYu-RC_51_RoHS_P_0.pdf; ComponentLink2Description: DigiKey Link; ComponentLink2URL: http://digikey.com/product-detail/en/yageo/RC0805FR-074K7P/YAG1325CT-ND/4935438; Composition: Thick Film; Device Package: 0805 (2012 Metric); Features: Moisture Resistant; Height - Seated (Max): 0.024" (0.60mm); LastUpdated: 02/09/2020 01:15:24; Lifecycle Status: Active; Minimum Order: 1; Number of Terminations: 2; Operating Temperature: -55°C ~ 155°C; Package / Case: 0805 (2012 Metric); Packaging: TapeAndReel; PartId: 27895; Part Status: Active; Price: 0.01; Resistance: 4.7 kOhms; Series: RC-P Lead Free; Size / Dimension: 0.079" L x 0.049" W (2.00mm x 1.25mm); Supplier 1: DigiKey; Supplier Part Number 1: YAG1325CT-ND; Supplier Device Package: 0805; Tolerance: ±1%
RESET = PTS645SM43SMTR92 LFS: SWITCH TACTILE SPST-NO 0.05A 12V; Manufacturer: C&K; Actuator Height off PCB, Vertical: 4.30mm; Actuator Orientation: Top Actuated; Actuator Type: Standard; Contact Rating @ Voltage: 0.05A @ 12VDC; Illumination: Non-Illuminated; Operating Force: 160gf; Outline: 6.00mm x 6.00mm; Switch Function: Off-Mom; Part Number: PTS645SM43SMTR92 LFS; Circuit: SPST-NO; ComponentLink1Description: Datasheet; ComponentLink1URL: https://dznh3ojzb2azq.cloudfront.net/products/Tactile/PTS645/documents/datasheet.pdf; ComponentLink2Description: DigiKey Link; ComponentLink2URL: http://digikey.com/product-detail/en/c-k/PTS645SM43SMTR92-LFS/CKN9112CT-ND/1146934; Features: Blue Actuator; LastUpdated: 09/04/2020 09:59:00; Lifecycle Status: Active; Minimum Order: 1; Mounting Type: Surface Mount; Operating Temperature: -20°C ~ 60°C; Packaging: TapeAndReel; Part Status: Active; Price: 0.09; Series: PTS645; Supplier 1: DigiKey; Supplier Part Number 1: CKN9112CT-ND; Termination Style: Gull Wing
SW1 SW2 = 218-4LPSTR: SWITCH SLIDE DIP SPST 25MA 24V; Manufacturer: CTS Electrocomponents; Actuator Level: Flush, Recessed; Actuator Type: Slide (Standard); Number of Positions: 4; Pitch: 0.050" (1.27mm), Half; Voltage Rating: 24VDC; Washable: Yes; Part Number: 218-4LPSTR; Circuit: SPST; ComponentLink1Description: Datasheet; ComponentLink1URL: https://www.ctscorp.com/wp-content/uploads/218.pdf; ComponentLink2Description: DigiKey Link; ComponentLink2URL: http://digikey.com/product-detail/en/cts-electrocomponents/218-4LPSTR/CT3110CT-ND/5875763; Contact Finish: Gold; Contact Material: Beryllium Copper; Current Rating (Amps): 25mA; Features: Epoxy Sealed Terminals, Tape Seal; Height Above Board: 0.104" (2.65mm); LastUpdated: 04/01/2020 18:53:14; Lifecycle Status: Active; Minimum Order: 1; Mounting Type: Surface Mount; Operating Temperature: -55°C ~ 85°C; Packaging: ReReel; PartId: 9; Part Status: Active; Price: 0.00; Series: 218; Supplier 1: DigiKey; Supplier Part Number 1: CT3110CT-ND; Termination Style: Gull Wing
U1 = ATMEGA2560-16AUR: ATMEGA2560 IC MCU 8BIT 256KB FLASH 100TQFP; Manufacturer: Microchip / Atmel; RAM Size: 8KB; Interface: I2C,SPI,UART,USART,EBI/EMI; Number of I/Os: 86; Number of Timers/Counters: 6; Frequency: 16MHz; Operating Supply Voltage: 5V; Max Supply Voltage: 5.5V; Min Supply Voltage: 4.5V; Oscillator Type: Internal; Data Bus Width: 8b; Watchdog Timer: Yes; Peripherals: Brown-out Detect/Reset,POR,PWM,WDT; Core Architecture: AVR; Supplier 1: Digi-Key; Manufacturer Part Number: ATMEGA2560-16AUR; RoHS: Yes; Category: Microcontrollers; Stock 1: 900; Pricing 1: 1=11.99000, 25=10.99000, 100=9.95010 (USD); Mount: Surface Mount; Case/Package: A; Number of Pins: 100; Contact Plating: Tin,Matte; Min Operating Temperature: -40°C; Max Operating Temperature: 85°C; Package Quantity: 1500; Packaging: Tape and Reel; Number of Programmable I/O: 86; Max Frequency: 16MHz; Memory Type: FLASH; Memory Size: 256KB; REACH SVHC: No SVHC; Lead Free: Lead Free; ComponentLink1URL: https://datasheet.ciiva.com/6641/atmel-2549-8-bit-avr-microcontroller-atmega640-1280-1281-2560-2561-summary-6641242.pdf?src-supplier=Digi-Key; ComponentLink1Description: https://datasheet.ciiva.com/6641/atmel-2549-8-bit-avr-microcontroller-atmega640-1280-1281-2560-2561-summary-6641242.pdf?src-supplier=Digi-Key; ComponentLink2URL: https://datasheet.ciiva.com/6641/atmel-2549-8-bit-avr-microcontroller-atmega640-1280-1281-2560-2561-summary-6641243.pdf?src-supplier=Digi-Key; ComponentLink2Description: https://datasheet.ciiva.com/6641/atmel-2549-8-bit-avr-microcontroller-atmega640-1280-1281-2560-2561-summary-6641243.pdf?src-supplier=Digi-Key; ComponentLink3URL: https://datasheet.ciiva.com/6641/atmel-2549-8-bit-avr-microcontroller-atmega640-1280-1281-2560-2561-summary-6641244.pdf?src-supplier=Digi-Key; ComponentLink3Description: https://datasheet.ciiva.com/6641/atmel-2549-8-bit-avr-microcontroller-atmega640-1280-1281-2560-2561-summary-6641244.pdf?src-supplier=Digi-Key; Supplier Part Number 1: ATMEGA2560-16AURCT-ND
U2 = SN74AHC1G09DBVR: TEXAS INSTRUMENTS - SN74AHC1G09DBVR - AND Gate, 74AHC1G09, 2 Input, 2 V to 5.5 V, SOT-23-5; Min Supply Voltage: 2V; Max Supply Voltage: 5.5V; Quiescent Current: 1uA; Number of Inputs: 2; Propagation Delay: 7.5ns; Output Current: 25mA; Number of Circuits: 1; Low Level Output Current: 8mA; Supplier 1: Digi-Key; Manufacturer: Texas Instruments; Manufacturer Part Number: SN74AHC1G09DBVR; RoHS: Yes; Category: Logic Gates; Stock 1: 8299; Pricing 1: 1=0.36000, 10=0.27100, 25=0.23760, 100=0.15370, 250=0.12720, 500=0.10176, 1000=0.07802 (USD); Mount: Surface Mount; Case/Package: SOT-23; Number of Pins: 5; Contact Plating: Tin,Matte; Min Operating Temperature: -55°C; Max Operating Temperature: 125°C; Logic Function: AND GATE; Package Quantity: 3000; Packaging: Tape and Reel; Number of Gates: 1; Number of Elements: 1; Number of Bits: 1; Series: 74AHC; Technology: CMOS; Output Voltage: 5.5V; Number of Outputs: 1; Radiation Hardening: No; REACH SVHC: No SVHC; Lead Free: Lead Free; RoHS Compliant: Yes; ComponentLink1URL: https://datasheet.ciiva.com/1864/sn74ahc1g09-1864410.pdf?src-supplier=Digi-Key; ComponentLink1Description: https://datasheet.ciiva.com/1864/sn74ahc1g09-1864410.pdf?src-supplier=Digi-Key; ComponentLink2URL: https://datasheet.ciiva.com/1864/sn74ahc1g09-1864411.pdf?src-supplier=Digi-Key; ComponentLink2Description: https://datasheet.ciiva.com/1864/sn74ahc1g09-1864411.pdf?src-supplier=Digi-Key; ComponentLink3URL: https://datasheet.ciiva.com/1864/sn74ahc1g09-1864412.pdf?src-supplier=Digi-Key; ComponentLink3Description: https://datasheet.ciiva.com/1864/sn74ahc1g09-1864412.pdf?src-supplier=Digi-Key; Supplier Part Number 1: 296-29202-1-ND
Y1 = ABLS-16.000MHZ-16-A-4-H-T: CRYSTAL 16.0000MHZ 16PF SMD; Manufacturer: Abracon LLC; ESR (Equivalent Series Resistance): 40 Ohms; Frequency Stability: ±35ppm; Frequency Tolerance: ±30ppm; Operating Mode: Fundamental; Part Number: ABLS-16.000MHZ-16-A-4-H-T; ComponentLink1Description: Datasheet; ComponentLink1URL: https://abracon.com/Resonators/abls.pdf; ComponentLink2Description: DigiKey Link; ComponentLink2URL: http://digikey.com/product-detail/en/abracon-llc/ABLS-16.000MHZ-16-A-4-H-T/535-14880-1-ND/9997957; Frequency: 16MHz; Height - Seated (Max): 0.165" (4.20mm); LastUpdated: 02/09/2020 01:21:46; Lifecycle Status: Active; Load Capacitance: 16pF; Minimum Order: 1; Mounting Type: Surface Mount; Operating Temperature: -10°C ~ 60°C; Package / Case: HC-49/US; Packaging: TapeAndReel; PartId: 68; Part Status: Active; Price: 0.12; Series: ABLS; Size / Dimension: 0.449" L x 0.185" W (11.40mm x 4.70mm); Supplier 1: DigiKey; Supplier Part Number 1: 535-14880-1-ND; Type: MHz Crystal; Value: 16MHz